# EasyEDA Pro project JP_WING_L.eprj

# Schematic Schematic1
Board Name: Board1; Create Date: 2025-08-31; Page Name: P1; Project Name: JP_WING; Schematic Name: Schematic1; Update Date: 2025-08-31; Company: EasyEDA.com; Page Size: A4; Version: V1.0
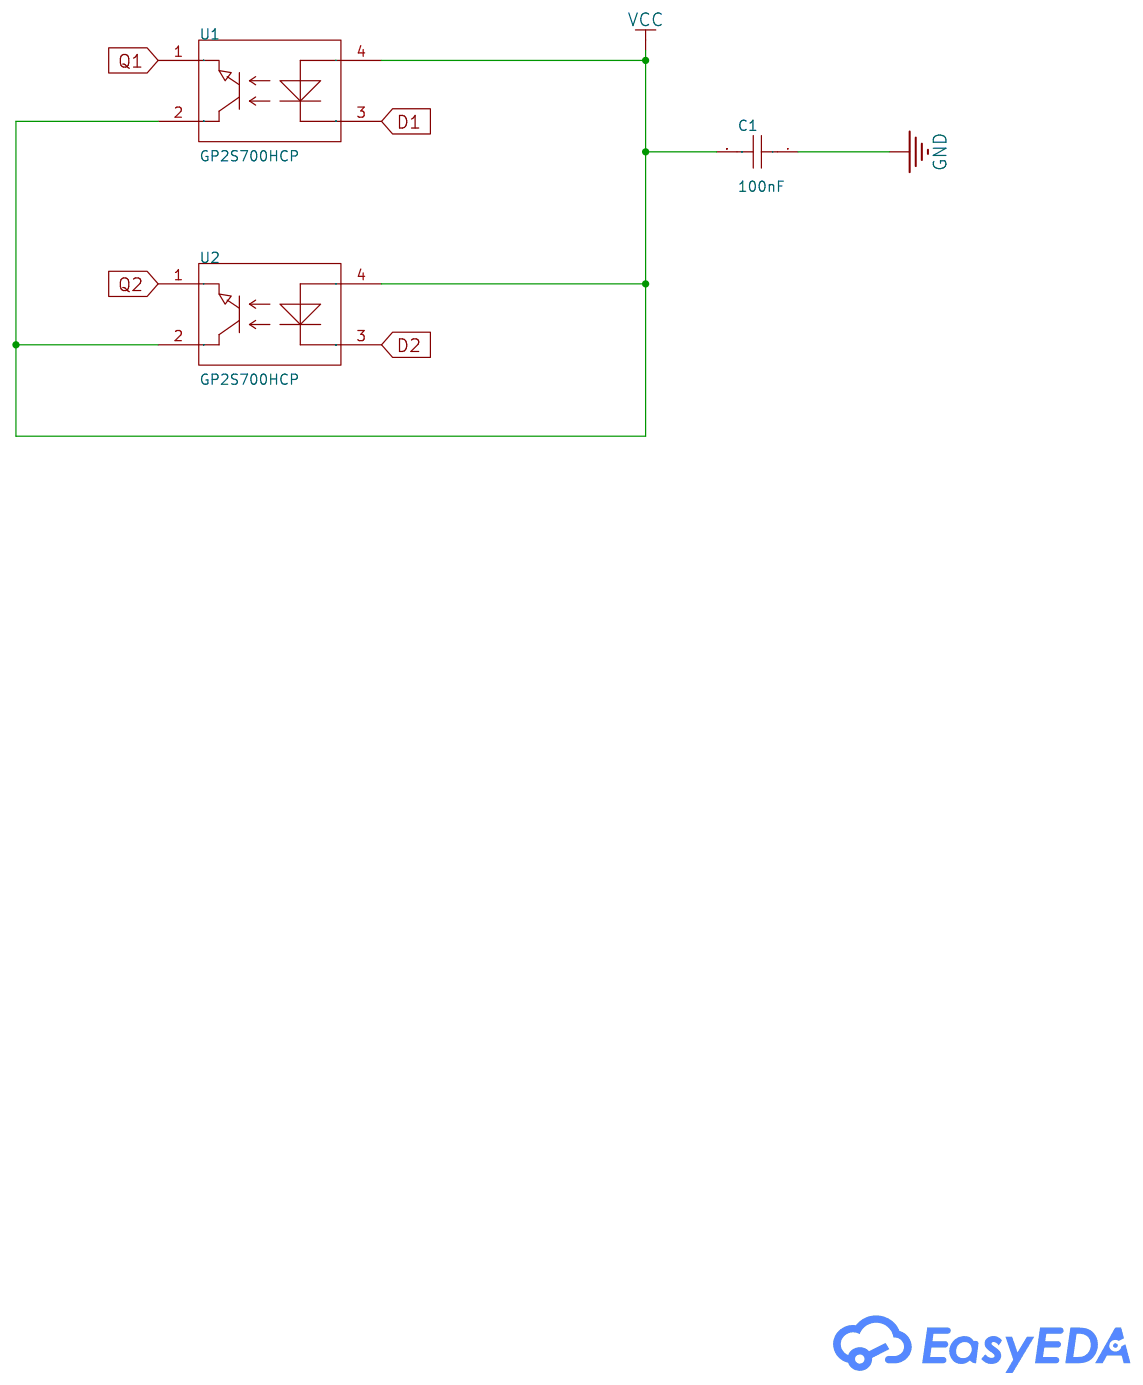
[diagram p0: schematic sheet]

## Parts
C1  100nF  [C0603]
U1  GP2S700HCP  [OPTO-SMD_GP2S700HCP]
U2  GP2S700HCP  [OPTO-SMD_GP2S700HCP]

## Library data of the parts
C1 = CAP_0603: Supplier Footprint: 0603
U1 U2 = GP2S700HCP: Sensing Distance:5.5mm Collector Current (Max):20mA; Supplier Part: C84392; Manufacturer: SHARP(夏普); Supplier Footprint: SMD-4P; JLCPCB Part Class: Extended Part; Datasheet: https://atta.szlcsc.com/upload/public/pdf/source/20180614/C84392_04826074CB7AA100700AE9A13738AF35.pdf; Supplier: LCSC; Sensing Distance: 5.5mm; Collector Current (Max): 20mA

## Nets
GND: C1.1
VCC: C1.2 U1.2 U1.4 U2.2 U2.4
D1: U1.3
D2: U2.3
Q1: U1.1
Q2: U2.1

# Board PCB1
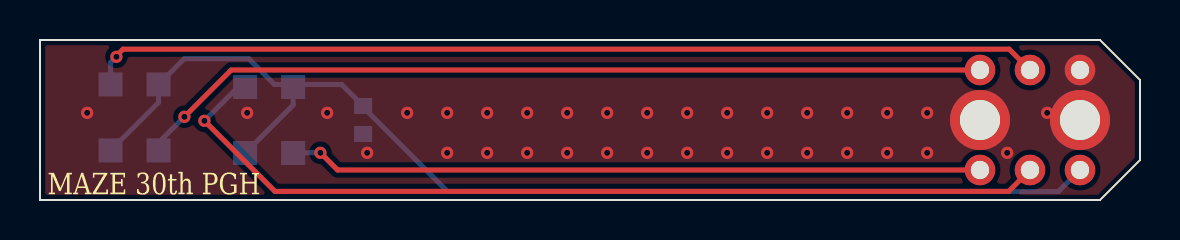
[diagram p1: board, top side]
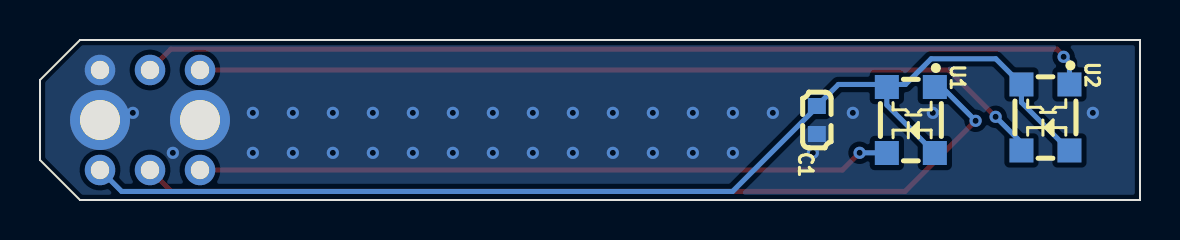
[diagram p2: board, bottom side, seen from below]

Outline 55 x 8 mm; copper layers: Top Layer, Bottom Layer. Coordinates in mm from the lower left corner of the outline.
Outline path: 0,0 0,8 53,8 55,6 55,2 53,0 0,0
Stack: Top Layer 0.035mm / Dielectric1 1.51mm FR4 er 4.5 / Bottom Layer 0.035mm

## Design rules (mm)
template: Custom Config
spacing copperThickness1oz (default): track to track 0.102, other pairs 0.152 to 0.3
spacing copperThickness2oz: track to track 0.203, other pairs 0.152 to 0.3
track width copperThickness1oz (default): min 0.127, default 0.254, max 2.54
track width copperThickness2oz: min 0.203, default 0.254, max 2.54
differential pair differentialPair (default): width min 0.127, default 0.254, max 2.54; gap min 0.152, default 0.152
via viaSize (default): diameter min 0.5, default 0.61, max 10; hole min 0.3, default 0.305, max 6.3

## Placement (name value [footprint] x y rotation side)
C1  100nF  [C0603]  16.16 4 90 bottom
NOREF  -  [Pad_e290]  47 4 180 top
NOREF#2  -  [Pad_e63]  49.5 1.5 180 top
NOREF#3  -  [Pad_e60]  47 1.5 180 top
NOREF#4  -  [Pad_e59]  52 1.5 180 top
NOREF#5  -  [Pad_e288]  52 4 180 top
NOREF#6  -  [Pad_e64]  49.5 6.5 180 top
NOREF#7  -  [Pad_e53]  52 6.5 180 top
NOREF#8  -  [Pad_e61]  47 6.5 180 top
U1  GP2S700HCP  [OPTO-SMD_GP2S700HCP]  11.46 4 270 bottom
U2  GP2S700HCP  [OPTO-SMD_GP2S700HCP]  4.73 4.13 270 bottom

## Footprints (pads in the part's own frame, mm; a bottom-side part is the same pattern mirrored in y, then rotated)
C0603
  rect 0.8x0.9 smd: 1(-0.7,0) 2(0.7,0)
OPTO-SMD_GP2S700HCP
  rect 1.2x1.2 smd: 1(-1.65,1.2) 2(-1.65,-1.2) 3(1.65,-1.2) 4(1.65,1.2)
Pad_e53
  round 1.524 hole 0.914: 1(0,0)
Pad_e59
  round 1.524 hole 0.914: 1(0,0)
Pad_e60
  round 1.524 hole 0.914: 2(0,0)
Pad_e61
  round 1.524 hole 0.914: 3(0,0)
Pad_e63
  round 1.524 hole 0.914: 1(0,0)
Pad_e64
  round 1.524 hole 0.914: 2(0,0)
Pad_e288
  round 3 hole 2: 1(0,0)
Pad_e290
  round 3 hole 2: 1(0,0)

## Nets
GND: C1.1 NOREF.1 NOREF#5.1 NOREF#7.1
VCC: C1.2 NOREF#4.1 U1.2 U1.4 U2.2 U2.4
D1: NOREF#3.2 U1.3
D2: NOREF#8.3 U2.3
Q1: NOREF#2.1 U1.1
Q2: NOREF#6.2 U2.1

## Via types
v1: diameter 0.61, hole 0.305, Top Layer to Bottom Layer, 37 vias

## Routing (per net, layer and track width the routed paths; a pad name or vN(x,y) marks a point on that pad's centre or on a via; arc(x,y) is an arc through that point)
GND:
  vias: v1(2.36,4.36) v1(10.36,4.36) v1(14.36,4.36) v1(16.36,2.36) v1(18.36,4.36) v1(20.36,4.36) v1(20.36,2.36) v1(22.36,4.36) v1(22.36,2.36) v1(24.36,4.36) v1(24.36,2.36) v1(26.36,4.36) v1(26.36,2.36) v1(28.36,4.36) v1(28.36,2.36) v1(30.36,4.36) v1(30.36,2.36) v1(32.36,4.36) v1(32.36,2.36) v1(34.36,4.36) v1(34.36,2.36) v1(36.36,4.36) v1(36.36,2.36) v1(38.36,4.36) v1(38.36,2.36) v1(40.36,4.36) v1(40.36,2.36) v1(42.36,4.36) v1(42.36,2.36) v1(44.36,4.36) v1(44.36,2.36) v1(48.36,2.36) v1(50.36,4.36)
VCC: length 58.6
  Bottom Layer w0.254: 52,1.51 50.92,0.43 20.37,0.43 16.16,4.64 C1.2 15.08,5.78 12.53,5.78 ; U1.4 12.66,4.75 U1.2 12.53,5.78 ; 12.53,5.78 11.73,5.78 10.44,7.06 7.21,7.06 5.93,5.78 5.93,4.88 U2.4
D1: length 34.7
  Top Layer w0.254: v1(14.02,2.36) 14.88,1.5 NOREF#3.2
  Bottom Layer w0.254: v1(14.02,2.36) 12.67,2.36 U1.3
D2: length 43
  Top Layer w0.254: NOREF#8.3 9.56,6.5 v1(7.22,4.16)
  Bottom Layer w0.254: 5.93,2.48 5.93,2.87 v1(7.22,4.16)
Q1: length 45.9
  Top Layer w0.254: v1(8.22,3.96) 11.75,0.43 48.43,0.43 NOREF#2.1
  Bottom Layer w0.254: U1.1 9.91,5.65 v1(8.22,3.96)
Q2: length 47.8
  Top Layer w0.254: NOREF#6.2 48.46,7.54 4.15,7.54 3.82,7.21 v1(3.82,7.16)
  Bottom Layer w0.254: v1(3.82,7.16) 3.53,6.87 U2.1

## Copper pours and planes (outline as drawn; the poured copper is in the pictures)
GND on Top Layer: -1.72,12.82 58.8,12.82 58.8,-3.8 -1.72,-3.8
GND on Bottom Layer: -3.58,10.06 57.02,10.06 57.02,-1.74 -3.58,-1.74

## Text on the board
Top Silkscreen Layer: MAZE 30th PGH
